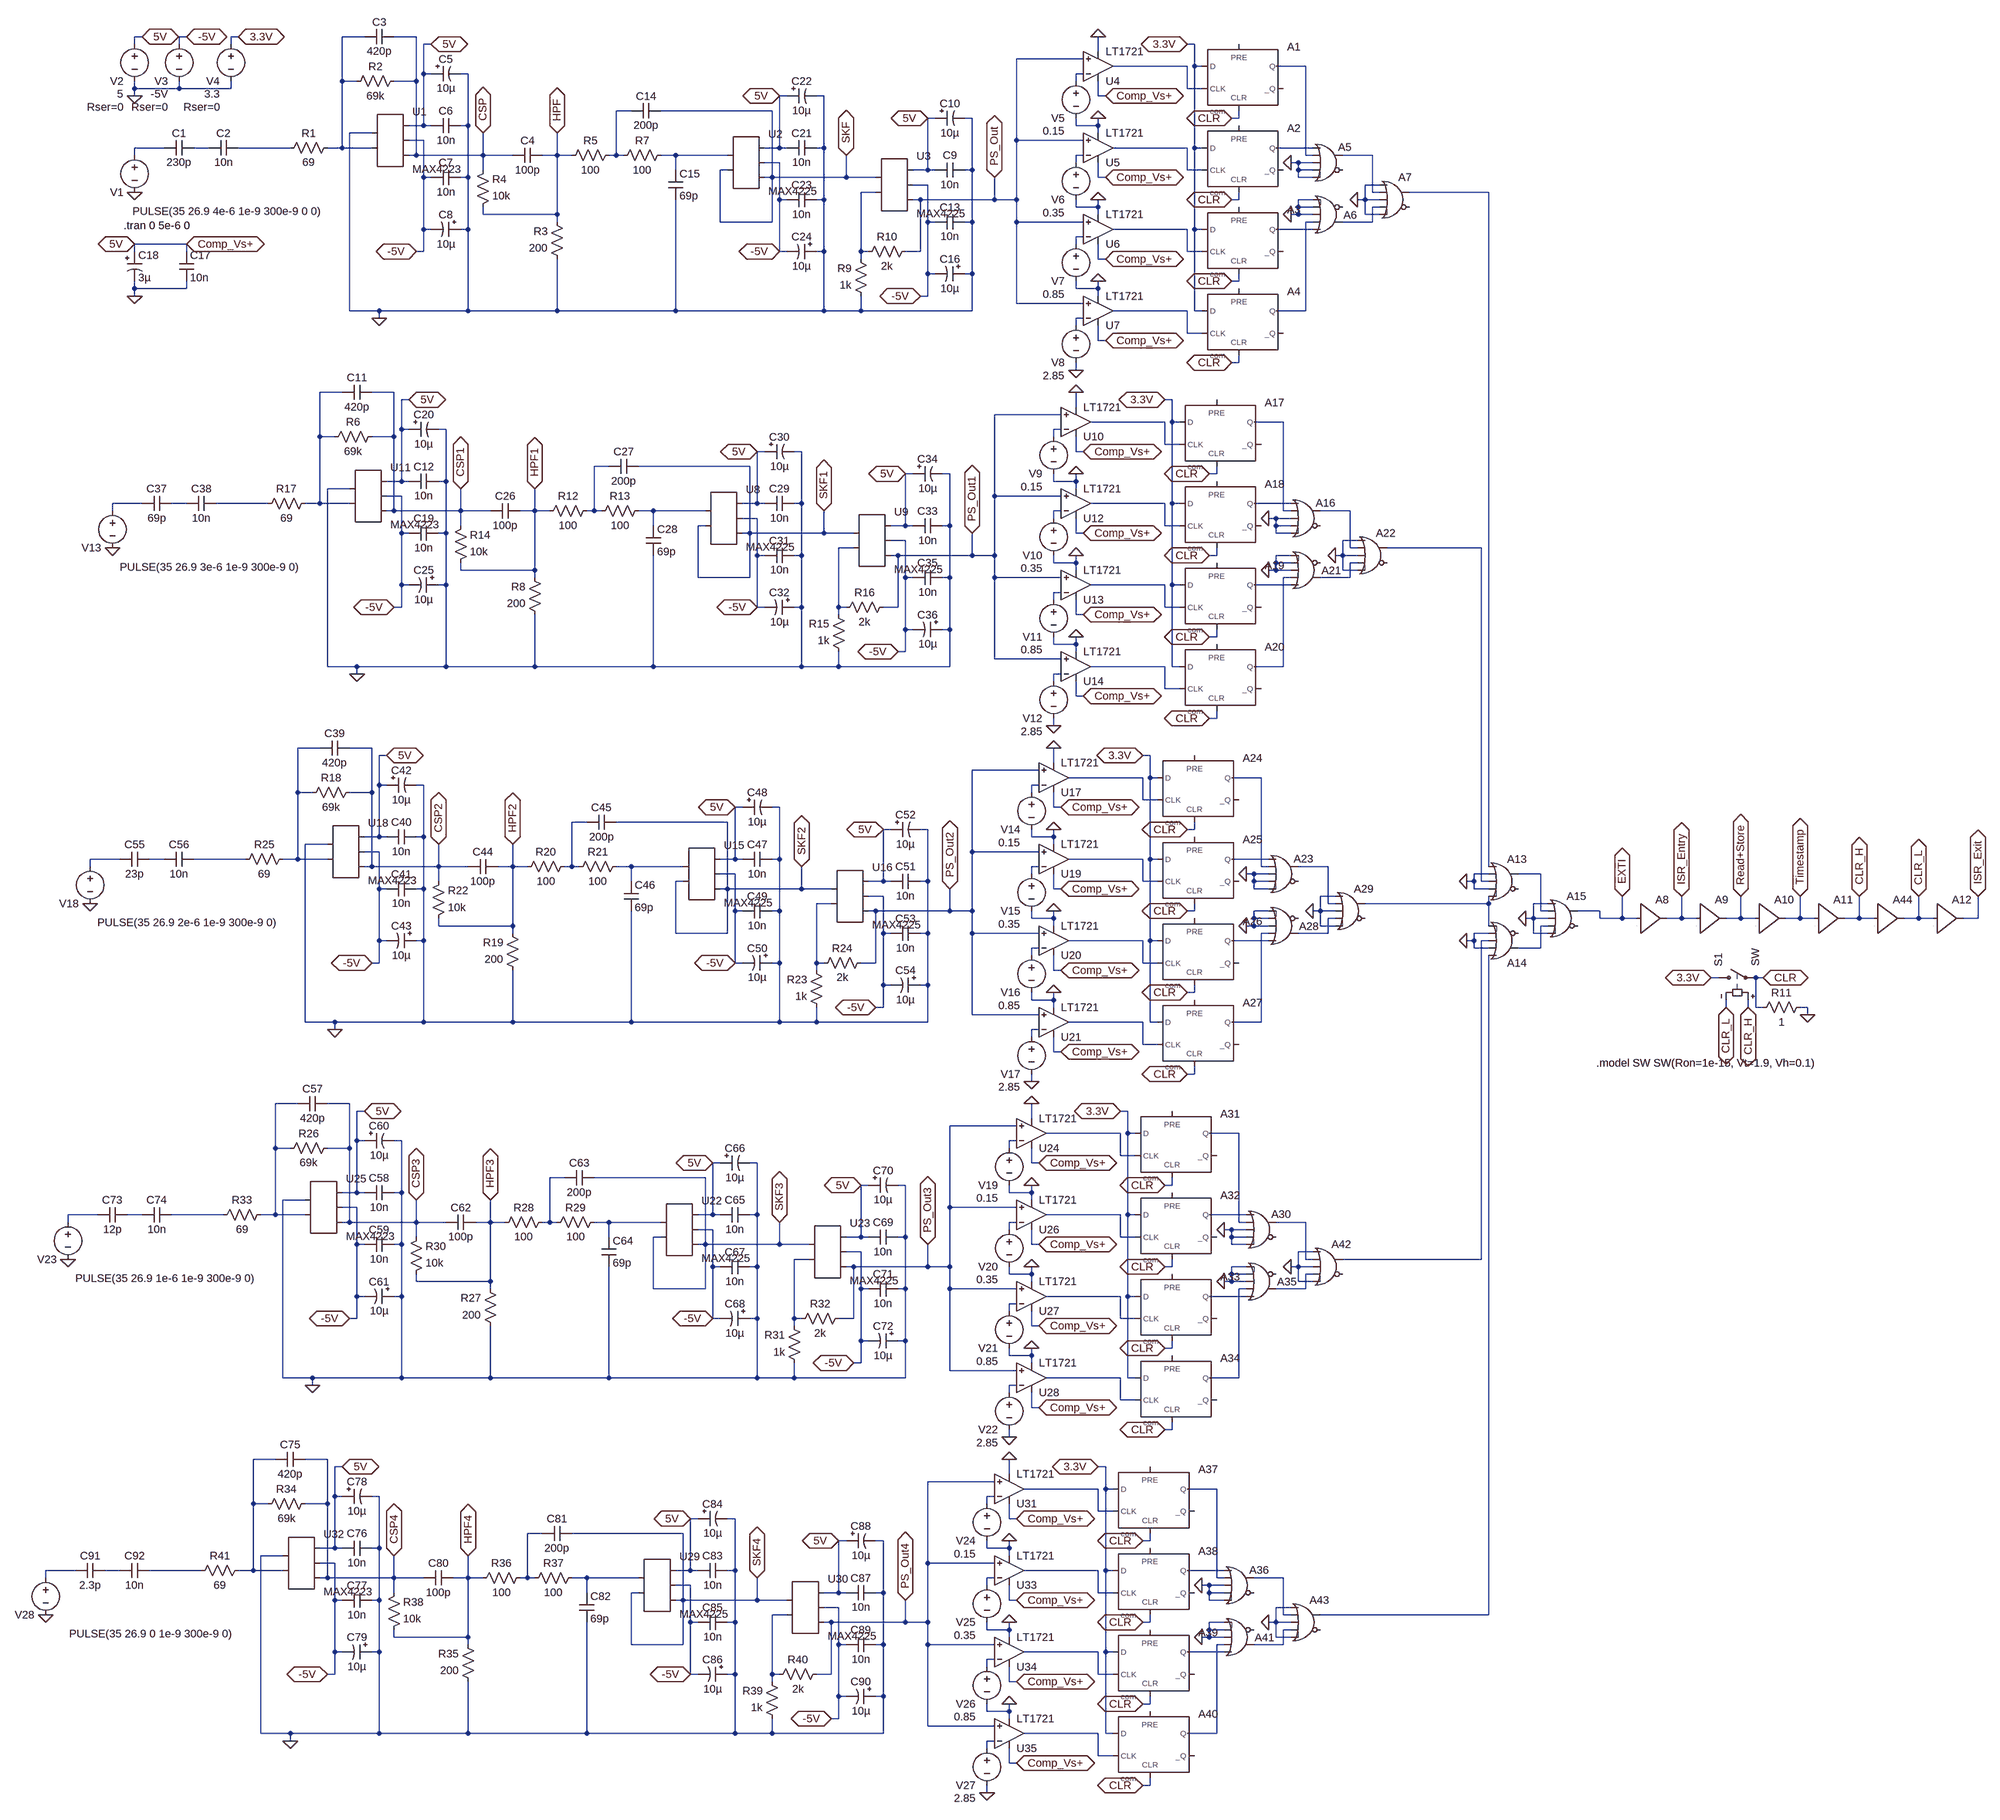
[diagram p0: schematic Radiation_to_OBC_TEST.asc]
* Radiation_to_OBC_TEST.asc
R1 N001 N008 69
C1 N007 N006 230p
V2 Comp_Vs+ 0 5 Rser=0
R2 CSP N001 69k
C3 CSP N001 420p
V1 N006 0 PULSE(35 26.9 4e-6 1e-9 300e-9 0 0)
C2 N008 N007 10n
C6 0 Comp_Vs+ 10n
C7 0 -5V 10n
C5 Comp_Vs+ 0 10µ
C8 0 -5V 10µ
R3 0 HPF 200
C4 HPF CSP 100p
R5 N005 HPF 100
C14 SKF N005 200p
R7 N011 N005 100
C15 N011 0 69p
* U2: MAX4225 (symbol AutoGenerated\MAX4225 not available, pins judged from their places): pin1=N011 pin2=SKF pin3=Comp_Vs+ pin4=-5V pin5=SKF
C21 0 Comp_Vs+ 10n
C22 Comp_Vs+ 0 10µ
C23 0 -5V 10n
C24 0 -5V 10µ
R4 HPF CSP 10k
C9 0 Comp_Vs+ 10n
C10 Comp_Vs+ 0 10µ
C13 0 -5V 10n
C16 0 -5V 10µ
* U3: MAX4225 (symbol AutoGenerated\MAX4225 not available, pins judged from their places): pin1=SKF pin2=N014 pin3=Comp_Vs+ pin4=-5V pin5=PS_Out
R9 0 N014 1k
R10 N014 PS_Out 2k
XU4 PS_Out N004 Comp_Vs+ 0 N002 LT1720  ; LT1721, pins In+ In- V+ V- OUT
* U1: MAX4223 (symbol AutoGenerated\MAX4223 not available, pins judged from their places): pin1=0 pin2=N001 pin3=Comp_Vs+ pin4=-5V pin5=CSP
A5 N010 N003 0 0 0 0 N013 0 OR Vhigh=2.5, Vlow=0.4, Ref=1.15 Trise=1.5e-9, Td=6e-9, Cout=3e-12
V3 -5V 0 -5V Rser=0
V4 3.3V 0 3.3 Rser=0
C17 0 Comp_Vs+ 10n
C18 Comp_Vs+ 0 3µ
V5 N004 0 0.15
XU5 PS_Out N012 Comp_Vs+ 0 N009 LT1720  ; LT1721, pins In+ In- V+ V- OUT
V6 N012 0 0.35
XU6 PS_Out N020 Comp_Vs+ 0 N018 LT1720  ; LT1721, pins In+ In- V+ V- OUT
V7 N020 0 0.85
XU7 PS_Out N022 Comp_Vs+ 0 N021 LT1720  ; LT1721, pins In+ In- V+ V- OUT
V8 N022 0 2.85
A1 3.3V 0 N002 0 CLR 0 N003 0 DFLOP Vhigh=2.4, Vlow=0.4, Ref=2 Trise=1.2e-9, Td=6e-9
A2 3.3V 0 N009 0 CLR 0 N010 0 DFLOP Vhigh=2.4, Vlow=0.4, Ref=2 Trise=1.2e-9, Td=6e-9
A3 3.3V 0 N018 0 CLR 0 N019 0 DFLOP Vhigh=2.4, Vlow=0.4, Ref=2 Trise=1.2e-9, Td=6e-9
A4 3.3V 0 N021 0 CLR 0 N017 0 DFLOP Vhigh=2.4, Vlow=0.4, Ref=2 Trise=1.2e-9, Td=6e-9
A6 N019 N017 0 0 0 0 N016 0 OR Vhigh=2.5, Vlow=0.4, Ref=1.15 Trise=1.5e-9, Td=6e-9, Cout=3e-12
A7 0 N013 0 N016 0 0 N015 0 OR Vhigh=2.5, Vlow=0.4, Ref=1.15 Trise=1.5e-9, Td=6e-9, Cout=3e-12
A8 EXTI 0 0 0 0 0 ISR_Entry 0 BUF Vhigh=3.3, Vlow=0.0, Ref=1.9 Trise=0, Td=375e-9
A10 Read+Store 0 0 0 0 0 Timestamp 0 BUF Vhigh=3.3, Vlow=0.0, Ref=1e-6 Trise=10e-9, Td=31.25e-9
S1 3.3V CLR CLR_H CLR_L SW
R11 CLR 0 1
A9 ISR_Entry 0 0 0 0 0 Read+Store 0 BUF Vhigh=3.3, Vlow=0.0, Ref=1e-6 Trise=0, Td=31.25e-9
A11 Timestamp 0 0 0 0 0 CLR_H 0 BUF Vhigh=3.3, Vlow=0.0, Ref=1e-6 Trise=10e-9, Td=31.25e-9
A12 CLR_L 0 0 0 0 0 ISR_Exit 0 BUF Vhigh=3.3, Vlow=0.0, Ref=11e-6 Trise=0, Td=312.5e-9
A13 N015 0 N037 0 N060 0 N058 0 OR Vhigh=2.5, Vlow=0.4, Ref=1.15 Trise=1.5e-9, Td=6e-9, Cout=3e-12
A14 N105 0 N066 0 N060 0 N062 0 OR Vhigh=2.5, Vlow=0.4, Ref=1.15 Trise=1.5e-9, Td=6e-9, Cout=3e-12
A15 0 N058 0 N062 0 0 EXTI 0 OR Vhigh=2.5, Vlow=0.4, Ref=1.15 Trise=1.5e-9, Td=6e-9, Cout=3e-12
R6 CSP1 N023 69k
C11 CSP1 N023 420p
C12 0 Comp_Vs+ 10n
C19 0 -5V 10n
C20 Comp_Vs+ 0 10µ
C25 0 -5V 10µ
R8 0 HPF1 200
C26 HPF1 CSP1 100p
R12 N027 HPF1 100
C27 SKF1 N027 200p
R13 N033 N027 100
C28 N033 0 69p
* U8: MAX4225 (symbol AutoGenerated\MAX4225 not available, pins judged from their places): pin1=N033 pin2=SKF1 pin3=Comp_Vs+ pin4=-5V pin5=SKF1
C29 0 Comp_Vs+ 10n
C30 Comp_Vs+ 0 10µ
C31 0 -5V 10n
C32 0 -5V 10µ
R14 HPF1 CSP1 10k
C33 0 Comp_Vs+ 10n
C34 Comp_Vs+ 0 10µ
C35 0 -5V 10n
C36 0 -5V 10µ
* U9: MAX4225 (symbol AutoGenerated\MAX4225 not available, pins judged from their places): pin1=SKF1 pin2=N036 pin3=Comp_Vs+ pin4=-5V pin5=PS_Out1
R15 0 N036 1k
R16 N036 PS_Out1 2k
XU10 PS_Out1 N026 Comp_Vs+ 0 N024 LT1720  ; LT1721, pins In+ In- V+ V- OUT
* U11: MAX4223 (symbol AutoGenerated\MAX4223 not available, pins judged from their places): pin1=0 pin2=N023 pin3=Comp_Vs+ pin4=-5V pin5=CSP1
A16 N032 N025 0 0 0 0 N035 0 OR Vhigh=2.5, Vlow=0.4, Ref=1.15 Trise=1.5e-9, Td=6e-9, Cout=3e-12
V9 N026 0 0.15
XU12 PS_Out1 N034 Comp_Vs+ 0 N031 LT1720  ; LT1721, pins In+ In- V+ V- OUT
V10 N034 0 0.35
XU13 PS_Out1 N042 Comp_Vs+ 0 N040 LT1720  ; LT1721, pins In+ In- V+ V- OUT
V11 N042 0 0.85
XU14 PS_Out1 N044 Comp_Vs+ 0 N043 LT1720  ; LT1721, pins In+ In- V+ V- OUT
V12 N044 0 2.85
A17 3.3V 0 N024 0 CLR 0 N025 0 DFLOP Vhigh=2.4, Vlow=0.4, Ref=2 Trise=1.2e-9, Td=6e-9
A18 3.3V 0 N031 0 CLR 0 N032 0 DFLOP Vhigh=2.4, Vlow=0.4, Ref=2 Trise=1.2e-9, Td=6e-9
A19 3.3V 0 N040 0 CLR 0 N041 0 DFLOP Vhigh=2.4, Vlow=0.4, Ref=2 Trise=1.2e-9, Td=6e-9
A20 3.3V 0 N043 0 CLR 0 N039 0 DFLOP Vhigh=2.4, Vlow=0.4, Ref=2 Trise=1.2e-9, Td=6e-9
A21 N041 N039 0 0 0 0 N038 0 OR Vhigh=2.5, Vlow=0.4, Ref=1.15 Trise=1.5e-9, Td=6e-9, Cout=3e-12
A22 0 N035 0 N038 0 0 N037 0 OR Vhigh=2.5, Vlow=0.4, Ref=1.15 Trise=1.5e-9, Td=6e-9, Cout=3e-12
R17 N023 N030 69
C37 N029 N028 69p
V13 N028 0 PULSE(35 26.9 3e-6 1e-9 300e-9 0)
C38 N030 N029 10n
R18 CSP2 N045 69k
C39 CSP2 N045 420p
C40 0 Comp_Vs+ 10n
C41 0 -5V 10n
C42 Comp_Vs+ 0 10µ
C43 0 -5V 10µ
R19 0 HPF2 200
C44 HPF2 CSP2 100p
R20 N049 HPF2 100
C45 SKF2 N049 200p
R21 N055 N049 100
C46 N055 0 69p
* U15: MAX4225 (symbol AutoGenerated\MAX4225 not available, pins judged from their places): pin1=N055 pin2=SKF2 pin3=Comp_Vs+ pin4=-5V pin5=SKF2
C47 0 Comp_Vs+ 10n
C48 Comp_Vs+ 0 10µ
C49 0 -5V 10n
C50 0 -5V 10µ
R22 HPF2 CSP2 10k
C51 0 Comp_Vs+ 10n
C52 Comp_Vs+ 0 10µ
C53 0 -5V 10n
C54 0 -5V 10µ
* U16: MAX4225 (symbol AutoGenerated\MAX4225 not available, pins judged from their places): pin1=SKF2 pin2=N059 pin3=Comp_Vs+ pin4=-5V pin5=PS_Out2
R23 0 N059 1k
R24 N059 PS_Out2 2k
XU17 PS_Out2 N048 Comp_Vs+ 0 N046 LT1720  ; LT1721, pins In+ In- V+ V- OUT
* U18: MAX4223 (symbol AutoGenerated\MAX4223 not available, pins judged from their places): pin1=0 pin2=N045 pin3=Comp_Vs+ pin4=-5V pin5=CSP2
A23 N054 N047 0 0 0 0 N057 0 OR Vhigh=2.5, Vlow=0.4, Ref=1.15 Trise=1.5e-9, Td=6e-9, Cout=3e-12
V14 N048 0 0.15
XU19 PS_Out2 N056 Comp_Vs+ 0 N053 LT1720  ; LT1721, pins In+ In- V+ V- OUT
V15 N056 0 0.35
XU20 PS_Out2 N067 Comp_Vs+ 0 N064 LT1720  ; LT1721, pins In+ In- V+ V- OUT
V16 N067 0 0.85
XU21 PS_Out2 N069 Comp_Vs+ 0 N068 LT1720  ; LT1721, pins In+ In- V+ V- OUT
V17 N069 0 2.85
A24 3.3V 0 N046 0 CLR 0 N047 0 DFLOP Vhigh=2.4, Vlow=0.4, Ref=2 Trise=1.2e-9, Td=6e-9
A25 3.3V 0 N053 0 CLR 0 N054 0 DFLOP Vhigh=2.4, Vlow=0.4, Ref=2 Trise=1.2e-9, Td=6e-9
A26 3.3V 0 N064 0 CLR 0 N065 0 DFLOP Vhigh=2.4, Vlow=0.4, Ref=2 Trise=1.2e-9, Td=6e-9
A27 3.3V 0 N068 0 CLR 0 N063 0 DFLOP Vhigh=2.4, Vlow=0.4, Ref=2 Trise=1.2e-9, Td=6e-9
A28 N065 N063 0 0 0 0 N061 0 OR Vhigh=2.5, Vlow=0.4, Ref=1.15 Trise=1.5e-9, Td=6e-9, Cout=3e-12
A29 0 N057 0 N061 0 0 N060 0 OR Vhigh=2.5, Vlow=0.4, Ref=1.15 Trise=1.5e-9, Td=6e-9, Cout=3e-12
R25 N045 N052 69
C55 N051 N050 23p
V18 N050 0 PULSE(35 26.9 2e-6 1e-9 300e-9 0)
C56 N052 N051 10n
R26 CSP3 N070 69k
C57 CSP3 N070 420p
C58 0 Comp_Vs+ 10n
C59 0 -5V 10n
C60 Comp_Vs+ 0 10µ
C61 0 -5V 10µ
R27 0 HPF3 200
C62 HPF3 CSP3 100p
R28 N074 HPF3 100
C63 SKF3 N074 200p
R29 N080 N074 100
C64 N080 0 69p
* U22: MAX4225 (symbol AutoGenerated\MAX4225 not available, pins judged from their places): pin1=N080 pin2=SKF3 pin3=Comp_Vs+ pin4=-5V pin5=SKF3
C65 0 Comp_Vs+ 10n
C66 Comp_Vs+ 0 10µ
C67 0 -5V 10n
C68 0 -5V 10µ
R30 HPF3 CSP3 10k
C69 0 Comp_Vs+ 10n
C70 Comp_Vs+ 0 10µ
C71 0 -5V 10n
C72 0 -5V 10µ
* U23: MAX4225 (symbol AutoGenerated\MAX4225 not available, pins judged from their places): pin1=SKF3 pin2=N083 pin3=Comp_Vs+ pin4=-5V pin5=PS_Out3
R31 0 N083 1k
R32 N083 PS_Out3 2k
XU24 PS_Out3 N073 Comp_Vs+ 0 N071 LT1720  ; LT1721, pins In+ In- V+ V- OUT
* U25: MAX4223 (symbol AutoGenerated\MAX4223 not available, pins judged from their places): pin1=0 pin2=N070 pin3=Comp_Vs+ pin4=-5V pin5=CSP3
A30 N079 N072 0 0 0 0 N082 0 OR Vhigh=2.5, Vlow=0.4, Ref=1.15 Trise=1.5e-9, Td=6e-9, Cout=3e-12
V19 N073 0 0.15
XU26 PS_Out3 N081 Comp_Vs+ 0 N078 LT1720  ; LT1721, pins In+ In- V+ V- OUT
V20 N081 0 0.35
XU27 PS_Out3 N088 Comp_Vs+ 0 N086 LT1720  ; LT1721, pins In+ In- V+ V- OUT
V21 N088 0 0.85
XU28 PS_Out3 N090 Comp_Vs+ 0 N089 LT1720  ; LT1721, pins In+ In- V+ V- OUT
V22 N090 0 2.85
A31 3.3V 0 N071 0 CLR 0 N072 0 DFLOP Vhigh=2.4, Vlow=0.4, Ref=2 Trise=1.2e-9, Td=6e-9
A32 3.3V 0 N078 0 CLR 0 N079 0 DFLOP Vhigh=2.4, Vlow=0.4, Ref=2 Trise=1.2e-9, Td=6e-9
A33 3.3V 0 N086 0 CLR 0 N087 0 DFLOP Vhigh=2.4, Vlow=0.4, Ref=2 Trise=1.2e-9, Td=6e-9
A34 3.3V 0 N089 0 CLR 0 N085 0 DFLOP Vhigh=2.4, Vlow=0.4, Ref=2 Trise=1.2e-9, Td=6e-9
A35 N087 N085 0 0 0 0 N084 0 OR Vhigh=2.5, Vlow=0.4, Ref=1.15 Trise=1.5e-9, Td=6e-9, Cout=3e-12
R33 N070 N077 69
C73 N076 N075 12p
V23 N075 0 PULSE(35 26.9 1e-6 1e-9 300e-9 0)
C74 N077 N076 10n
R34 CSP4 N091 69k
C75 CSP4 N091 420p
C76 0 Comp_Vs+ 10n
C77 0 -5V 10n
C78 Comp_Vs+ 0 10µ
C79 0 -5V 10µ
R35 0 HPF4 200
C80 HPF4 CSP4 100p
R36 N095 HPF4 100
C81 SKF4 N095 200p
R37 N101 N095 100
C82 N101 0 69p
* U29: MAX4225 (symbol AutoGenerated\MAX4225 not available, pins judged from their places): pin1=N101 pin2=SKF4 pin3=Comp_Vs+ pin4=-5V pin5=SKF4
C83 0 Comp_Vs+ 10n
C84 Comp_Vs+ 0 10µ
C85 0 -5V 10n
C86 0 -5V 10µ
R38 HPF4 CSP4 10k
C87 0 Comp_Vs+ 10n
C88 Comp_Vs+ 0 10µ
C89 0 -5V 10n
C90 0 -5V 10µ
* U30: MAX4225 (symbol AutoGenerated\MAX4225 not available, pins judged from their places): pin1=SKF4 pin2=N104 pin3=Comp_Vs+ pin4=-5V pin5=PS_Out4
R39 0 N104 1k
R40 N104 PS_Out4 2k
XU31 PS_Out4 N094 Comp_Vs+ 0 N092 LT1720  ; LT1721, pins In+ In- V+ V- OUT
* U32: MAX4223 (symbol AutoGenerated\MAX4223 not available, pins judged from their places): pin1=0 pin2=N091 pin3=Comp_Vs+ pin4=-5V pin5=CSP4
A36 N100 N093 0 0 0 0 N103 0 OR Vhigh=2.5, Vlow=0.4, Ref=1.15 Trise=1.5e-9, Td=6e-9, Cout=3e-12
V24 N094 0 0.15
XU33 PS_Out4 N102 Comp_Vs+ 0 N099 LT1720  ; LT1721, pins In+ In- V+ V- OUT
V25 N102 0 0.35
XU34 PS_Out4 N110 Comp_Vs+ 0 N108 LT1720  ; LT1721, pins In+ In- V+ V- OUT
V26 N110 0 0.85
XU35 PS_Out4 N112 Comp_Vs+ 0 N111 LT1720  ; LT1721, pins In+ In- V+ V- OUT
V27 N112 0 2.85
A37 3.3V 0 N092 0 CLR 0 N093 0 DFLOP Vhigh=2.4, Vlow=0.4, Ref=2 Trise=1.2e-9, Td=6e-9
A38 3.3V 0 N099 0 CLR 0 N100 0 DFLOP Vhigh=2.4, Vlow=0.4, Ref=2 Trise=1.2e-9, Td=6e-9
A39 3.3V 0 N108 0 CLR 0 N109 0 DFLOP Vhigh=2.4, Vlow=0.4, Ref=2 Trise=1.2e-9, Td=6e-9
A40 3.3V 0 N111 0 CLR 0 N107 0 DFLOP Vhigh=2.4, Vlow=0.4, Ref=2 Trise=1.2e-9, Td=6e-9
A41 N109 N107 0 0 0 0 N106 0 OR Vhigh=2.5, Vlow=0.4, Ref=1.15 Trise=1.5e-9, Td=6e-9, Cout=3e-12
R41 N091 N098 69
C91 N097 N096 2.3p
V28 N096 0 PULSE(35 26.9 0 1e-9 300e-9 0)
C92 N098 N097 10n
A42 0 N082 0 N084 0 0 N066 0 OR Vhigh=2.5, Vlow=0.4, Ref=1.15 Trise=1.5e-9, Td=6e-9, Cout=3e-12
A43 0 N103 0 N106 0 0 N105 0 OR Vhigh=2.5, Vlow=0.4, Ref=1.15 Trise=1.5e-9, Td=6e-9, Cout=3e-12
A44 CLR_H 0 0 0 0 0 CLR_L 0 BUF Vhigh=3.3, Vlow=0.0, Ref=1e-6 Trise=10e-9, Td=31.25e-9
.tran 0 5e-6 0
.model SW SW(Ron=1e-15, Vt=1.9, Vh=0.1)
.lib LTC.lib
.backanno
.end